# EAGLE design peripheral (EAGLE 9.3.0)
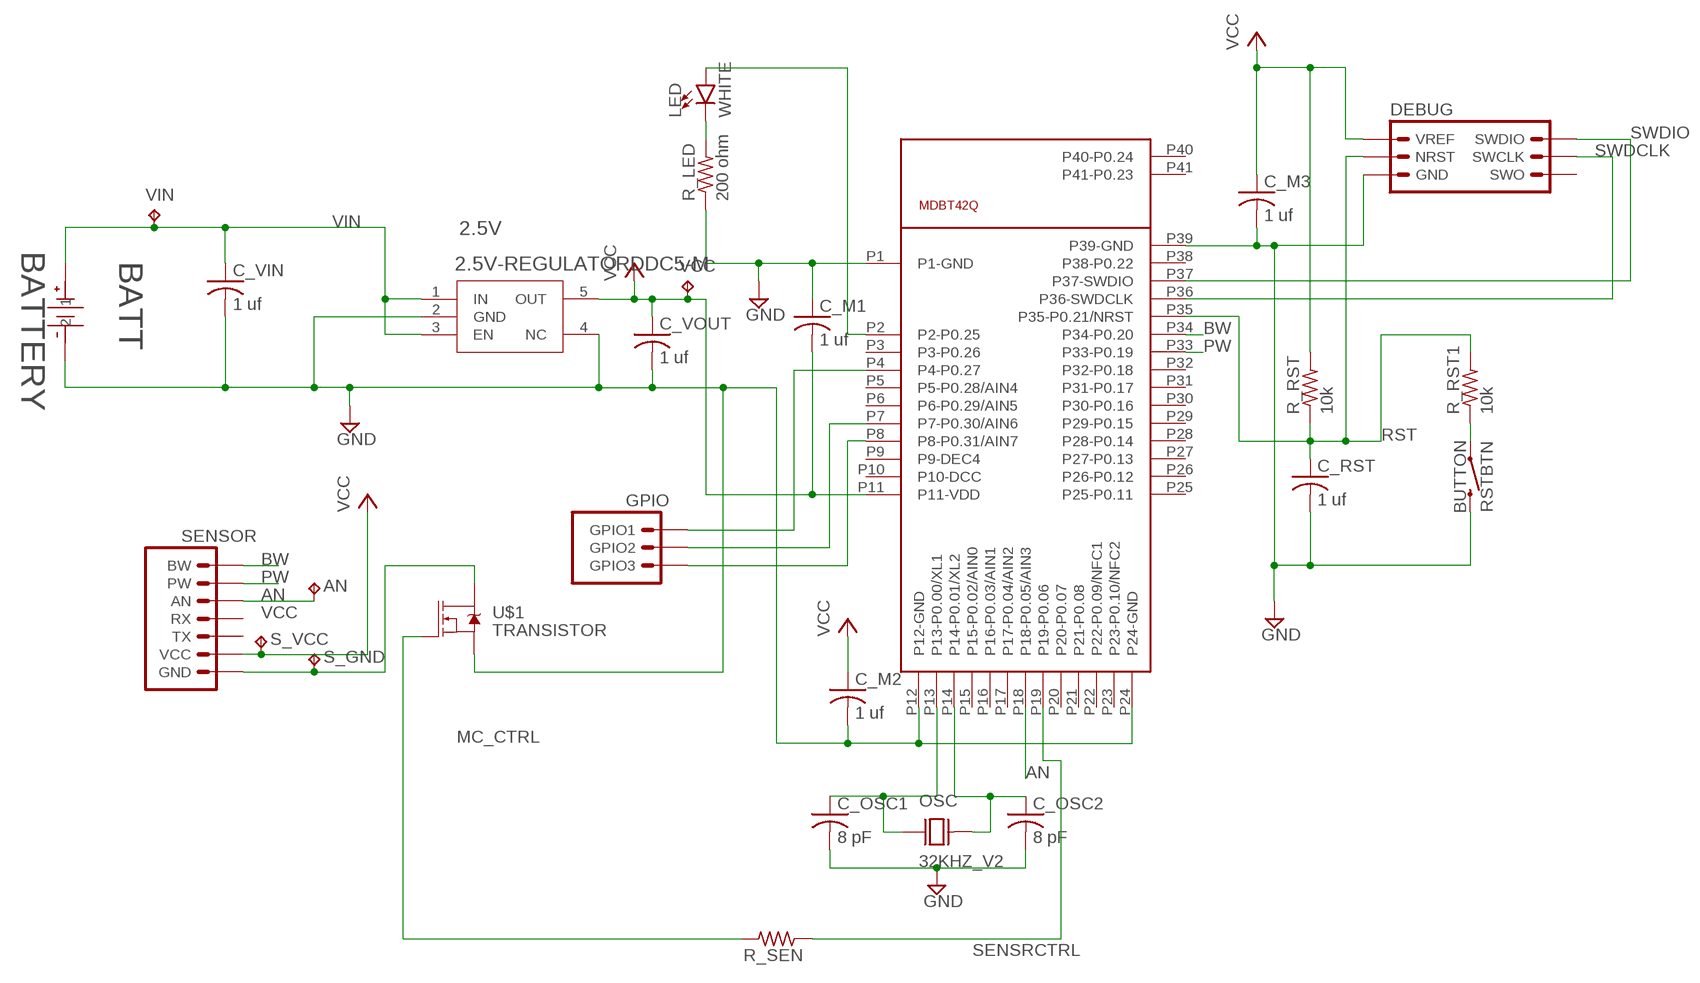
[diagram p0: schematic, sheet 1]

## Parts
2.5V  2.5V-REGULATORDDC5-M  [DDC5-M]
AN  TPTP11SQ  [TP11SQ]
BATT  BATTERY  [BAT_HLDR_2468]
C_M1  1 uf  CAP  [C0805K]
C_M2  1 uf  CAP  [C0805K]
C_M3  1 uf  CAP  [C0805K]
C_OSC1  8 pF  CAP  [C0805K]
C_OSC2  8 pF  CAP  [C0805K]
C_RST  1 uf  CAP  [C0805K]
C_VIN  1 uf  CAP  [C0805K]
C_VOUT  1 uf  CAP  [C0805K]
DEBUG  DEBUGGER  [MA03-2]
GPIO  GPIO  [MA03-1]
LED  WHITE  LED_12061206  [LED-1206]
MICRO  MDBT42Q  [MDBT40]
OSC  32KHZ_V2  [XTAL_AB26TRB-32.768KHZ-T]
R_LED  200 ohm  RESISTOR  [M0805]
R_RST  10k  RESISTOR  [M0805]
R_RST1  10k  RESISTOR  [M0805]
R_SEN  RESISTOR  [M0805]
RSTBTN  BUTTON  [TACTILE_SWITCH_SMD_6.2MM_TALL]
S_GND  TPTP11SQ  [TP11SQ]
S_VCC  TPTP11SQ  [TP11SQ]
SENSOR  SENSORHEADER  [MA07-1]
U$1  TRANSISTOR  [SOT23-3]
VCC  TPTP11SQ  [TP11SQ]
VIN  TPTP11SQ  [TP11SQ]

## Nets
AN: AN.TP MICRO.P18(P18-P0.05/AIN3) SENSOR.5(AN)
BW: MICRO.P34(P34-P0.20) SENSOR.7(BW)
GND: 2.5V.2(GND) 2.5V.4(NC) BATT.2 BATT.3 BATT.4 C_M1.1 C_M2.2 C_M3.2 C_OSC1.2 C_OSC2.2 C_RST.2 C_VIN.2 C_VOUT.2 DEBUG.2(GND) MICRO.P1(P1-GND) MICRO.P12(P12-GND) MICRO.P24(P24-GND) MICRO.P39(P39-GND) R_LED.1 RSTBTN.TOP1 RSTBTN.TOP2 U$1.2_S(S)
MC_CTRL: R_SEN.2 U$1.1_G(G)
N$1: C_OSC1.1 MICRO.P13(P13-P0.00/XL1) OSC.P$3
N$2: LED.C R_LED.2
N$3: C_OSC2.1 MICRO.P14(P14-P0.01/XL2) OSC.P$4
N$4: S_GND.TP SENSOR.1(GND) U$1.3_D(D)
N$6: LED.A MICRO.P2(P2-P0.25)
N$7: R_RST1.1 RSTBTN.BOTTOM1 RSTBTN.BOTTOM2
N$10: GPIO.1(GPIO3) MICRO.P8(P8-P0.31/AIN7)
N$13: GPIO.2(GPIO2) MICRO.P7(P7-P0.30/AIN6)
N$14: GPIO.3(GPIO1) MICRO.P4(P4-P0.27)
PW: MICRO.P33(P33-P0.19) SENSOR.6(PW)
RST: C_RST.1 DEBUG.4(NRST) MICRO.P35(P35-P0.21/NRST) R_RST1.2 R_RST.1
SENSRCTRL: MICRO.P19(P19-P0.06) R_SEN.1
SWDCLK: DEBUG.3(SWCLK) MICRO.P36(P36-SWDCLK)
SWDIO: DEBUG.5(SWDIO) MICRO.P37(P37-SWDIO)
VCC: 2.5V.5(OUT) C_M1.2 C_M2.1 C_M3.1 C_VOUT.1 DEBUG.6(VREF) MICRO.P11(P11-VDD) R_RST.2 S_VCC.TP SENSOR.2(VCC) VCC.TP
VIN: 2.5V.1(IN) 2.5V.3(EN) BATT.1 C_VIN.1 VIN.TP
Unconnected: DEBUG.1(SWO) MICRO.P3(P3-P0.26) MICRO.P5(P5-P0.28/AIN4) MICRO.P6(P6-P0.29/AIN5) MICRO.P9(P9-DEC4) MICRO.P10(P10-DCC) MICRO.P15(P15-P0.02/AIN0) MICRO.P16(P16-P0.03/AIN1) MICRO.P17(P17-P0.04/AIN2) MICRO.P20(P20-P0.07) MICRO.P21(P21-P0.08) MICRO.P22(P22-P0.09/NFC1) MICRO.P23(P23-P0.10/NFC2) MICRO.P25(P25-P0.11) MICRO.P26(P26-P0.12) MICRO.P27(P27-P0.13) MICRO.P28(P28-P0.14) MICRO.P29(P29-P0.15) MICRO.P30(P30-P0.16) MICRO.P31(P31-P0.17) MICRO.P32(P32-P0.18) MICRO.P38(P38-P0.22) MICRO.P40(P40-P0.24) MICRO.P41(P41-P0.23) SENSOR.3(TX) SENSOR.4(RX)

## Library data of the parts
2.5V = third_eye:2.5V-REGULATOR; MANUFACTURER_PART_NUMBER: TLV70025DDCR; VENDOR: Texas Instruments
AN S_GND S_VCC VCC VIN = testpad:TP: Test pad
BATT = third_eye:BATTERY; MANUFACTURER_PART_NUMBER: 2468; VENDOR: SILICON LABS
C_M1-C_M3 C_OSC1 C_OSC2 C_RST C_VIN C_VOUT = third_eye:CAP
DEBUG = third_eye:DEBUGGER: PIN HEADER; OC_FARNELL: unknown; OC_NEWARK: unknown
GPIO = third_eye:GPIO: PIN HEADER; OC_FARNELL: unknown; OC_NEWARK: unknown
LED = third_eye:LED_1206: White SMD LED Used in manufacturing several products at SparkFun. Packages: 0603 - Bright White SMD 0603 package[Product Link] <http://www.kingbrightusa.com/product.asp?catalog_name=LED&product_id=APT1608QWF/D> 1206 - Bright White SMD1206 package [Product Link] <http://www.kingbrightusa.com/product.asp?catalog_name=LED&product_id=APT3216QWF/D> 3014 - Super Bright SMD 3014 package [Datasheet] <http://www.lumileds.com/uploads/459/DS208-pdf> SparkFun Products: Blackberry Trackballer Breakout <https://www.sparkfun.com/products/13169> Digital SandBox <https://www.sparkfun.com/products/12651>; PROD_ID: DIO-09955
MICRO = third_eye:MDBT42Q
OSC = third_eye:32KHZ_V2: AB26TRB Series 32.768 kHz ±20 ppm 12.5 pF -40 to +85°C Cylindrical Watch Crystal; DESCRIPTION: AB26TRB Series 32.768 kHz ±20 ppm 12.5 pF -40 to +85°C Cylindrical Watch Crystal; DIGI-KEY_PART_NUMBER: 535-9033-1-ND; DIGI-KEY_PURCHASE_URL: https://www.digikey.com/product-detail/en/abracon-llc/AB26TRB-32.768KHZ-T/535-9033-1-ND/675581?utm_source=snapeda&utm_medium=aggregator&utm_campaign=symbol; MF: Abracon; MP: AB26TRB-32.768KHZ-T; PACKAGE: Cylindrical Can Radial Abracon
R_LED R_RST R_RST1 R_SEN = third_eye:RESISTOR
RSTBTN = third_eye:BUTTON
SENSOR = third_eye:SENSORHEADER: PIN HEADER; OC_FARNELL: unknown; OC_NEWARK: unknown
U$1 = third_eye:TRANSISTOR

## Board
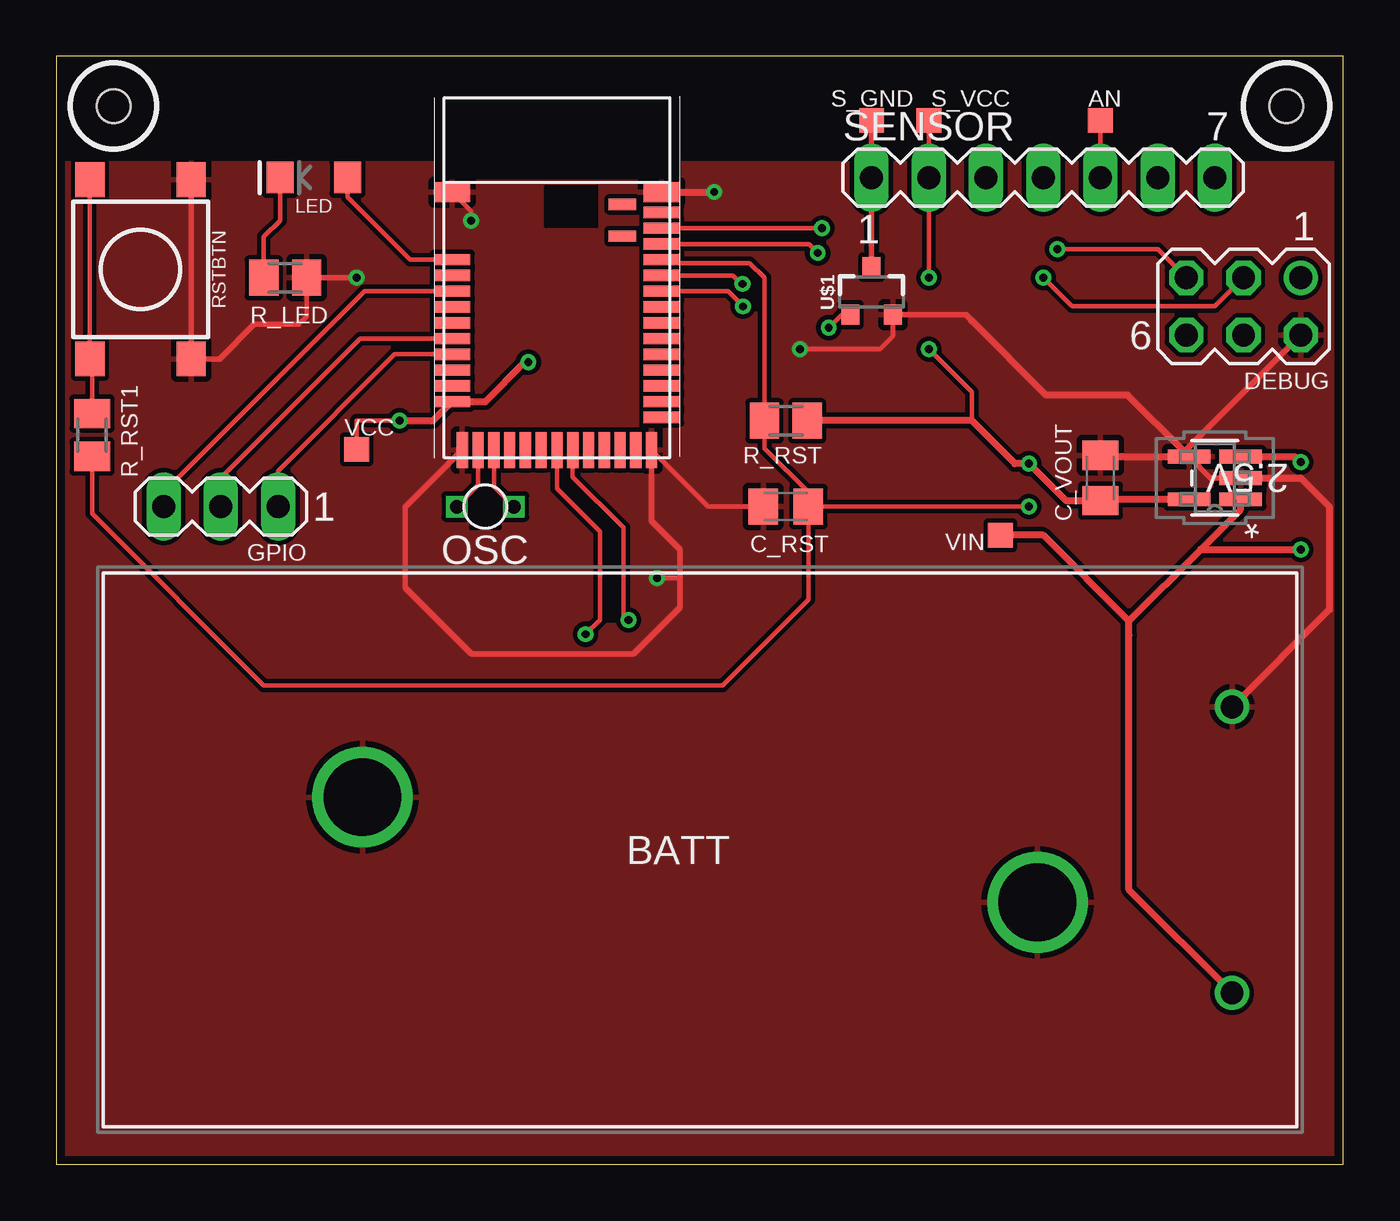
[diagram p1: board, top side]
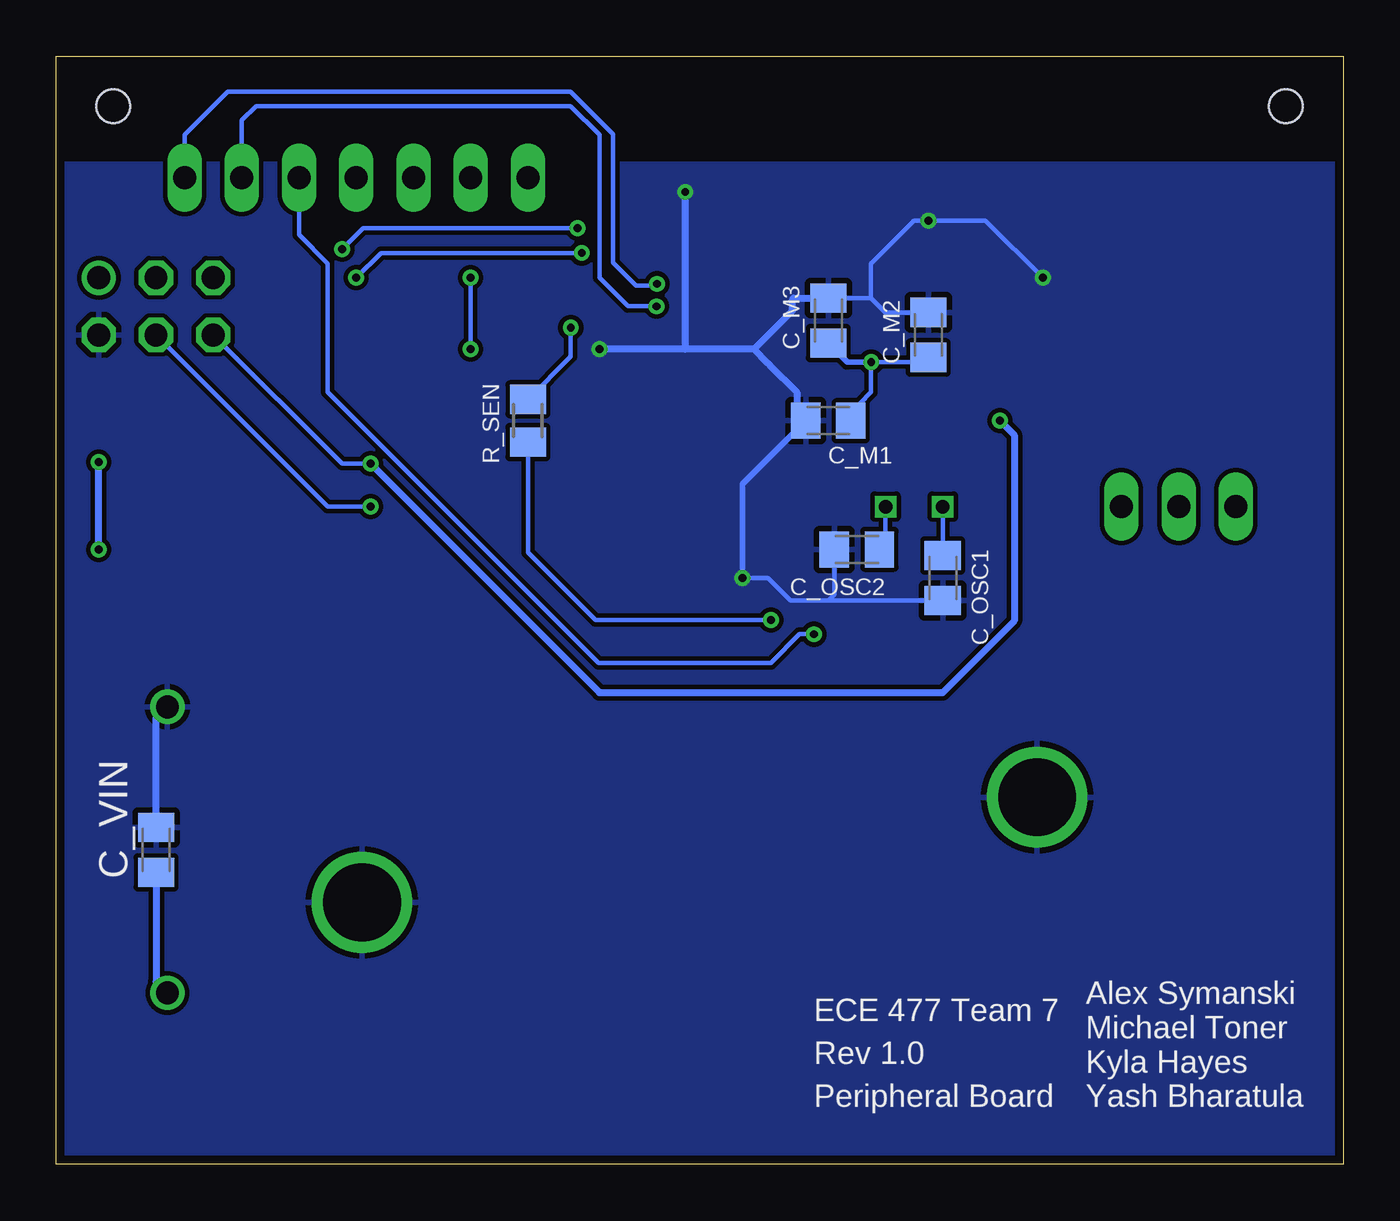
[diagram p2: board, bottom side, seen from below]

Size 57.13 x 49.2 mm. Coordinates in mm from the lower left corner, seen from the top.
Outline: 0,0 57.13,0 57.13,49.2 0,49.2 0,0
Copper layers (1*16): Top 0.0356mm / dielectric 1.5011mm / Bottom 0.0356mm
Design rules "ECE_Senior_Design": minimum track width 8mil, minimum drill 13mil, track to track 8mil, track to pad 8mil, pad to pad 6mil, via to via 8mil, smd to smd 6mil, copper to edge 15mil, drill to drill 8mil, minimum pad ring 7mil, minimum via ring 7mil, stop-mask expansion 3mil, vias tented up to drill 0mil, thermal gap 10mil
Holes 1.5 mm at 2.54,46.99 54.61,46.99
tRestrict: area 22.5,24.1 to 24.8,30.3; area 18.4,28.3 to 19.7,29.5; area 16.8,43.8 to 27.6,45.4

### Footprints (pad centres in the part's own frame; a part is rotated, then mirrored left to right if it is on the bottom)
DDC5-M = smd 1.88 x 0.61: 1 -1.143,0.95; 2 -1.143,0; 3 -1.143,-0.95; 4 1.143,-0.95; 5 1.143,0.95
TP11SQ = smd 1.1 x 1.1: TP 0,0
BAT_HLDR_2468 = drill 1.016 pad 1.524: 1 23.622,-6.35; 2 23.622,6.35 | drill 3.454 pad 3.962: 3 -14.986,2.337; 4 14.986,-2.337
C0805K = smd 1.3 x 1.6: 1 -1,0; 2 1,0
MA03-2 = drill 1.016: 1 -2.54,-1.27 | drill 1.016 octagon: 2 -2.54,1.27; 3 0,-1.27; 4 0,1.27; 5 2.54,-1.27; 6 2.54,1.27
MA03-1 = drill 1.016 long: 1 -2.54,0; 2 0,0; 3 2.54,0
LED-1206 = smd 1.2 x 1.4: A -1.5,0; C 1.5,0
MDBT40 = smd 1.6 x 0.9: P1 -4.65,3.8; P39 4.65,3.8 | smd 1.6 x 0.5: P2 -4.65,0.8; P3 -4.65,0.1; P4 -4.65,-0.6; P5 -4.65,-1.3; P6 -4.65,-2; P7 -4.65,-2.7; P8 -4.65,-3.4; P9 -4.65,-4.1; P10 -4.65,-4.8; P11 -4.65,-5.5; P25 4.65,-6.2; P26 4.65,-5.5; P27 4.65,-4.8; P28 4.65,-4.1; P29 4.65,-3.4; P30 4.65,-2.7; P31 4.65,-2; P32 4.65,-1.3; P33 4.65,-0.6; P34 4.65,0.1; P35 4.65,0.8; P36 4.65,1.5; P37 4.65,2.2; P38 4.65,2.9 | smd 0.5 x 1.6: P12 -4.2,-7.65; P13 -3.5,-7.65; P14 -2.8,-7.65; P15 -2.1,-7.65; P16 -1.4,-7.65; P17 -0.7,-7.65; P18 0,-7.65; P19 0.7,-7.65; P20 1.4,-7.65; P21 2.1,-7.65; P22 2.8,-7.65; P23 3.5,-7.65; P24 4.2,-7.65 | smd 1.2 x 0.5: P40 2.9,3.25; P41 2.9,1.85
XTAL_AB26TRB-32.768KHZ-T = drill 0.6 square: P$3 0,1.27; P$4 0,-1.27
M0805 = smd 1.3 x 1.6: 1 -0.95,0; 2 0.95,0
TACTILE_SWITCH_SMD_6.2MM_TALL = smd 1.55 x 1.3: BOTTOM1 -3.975,-2.25; BOTTOM2 3.975,-2.25; TOP1 -3.975,2.25; TOP2 3.975,2.25
MA07-1 = drill 1.016 long: 1 -7.62,0; 2 -5.08,0; 3 -2.54,0; 4 0,0; 5 2.54,0; 6 5.08,0; 7 7.62,0
SOT23-3 = smd 0.8 x 0.9: 1_G -0.95,-1; 2_S 0.95,-1; 3_D 0,1.1

### Placement (x,y rotation side)
2.5V  51.44,30.48 180 top
AN  46.36,46.35 0 top
BATT  28.57,13.97 0 top
C_M1  22.86,33.02 0 bottom
C_M2  18.41,36.83 90 bottom
C_M3  22.86,37.46 90 bottom
C_OSC1  17.78,26.04 270 bottom
C_OSC2  21.59,27.3 180 bottom
C_RST  32.39,29.21 180 top
C_VIN  52.71,13.97 90 bottom
C_VOUT  46.36,30.48 90 top
DEBUG  52.71,38.1 180 top
GPIO  7.3,29.21 180 top
LED  11.43,43.81 180 top
MICRO  22.22,39.37 0 top
OSC  19.05,29.21 90 top
R_LED  10.16,39.37 180 top
R_RST  32.39,33.02 0 top
R_RST1  1.59,32.38 270 top
R_SEN  36.2,33.02 90 bottom
RSTBTN  3.74,39.74 270 top
S_GND  36.2,46.35 0 top
S_VCC  38.73,46.35 0 top
SENSOR  43.82,43.81 0 top
U$1  36.2,38.73 0 top
VCC  13.34,31.75 0 top
VIN  41.91,27.94 0 top

### Tracks (layer width: path | path; a pad name or v marks a point on that pad's centre or on a via)
AN  (via drill 0.35)
  Top 0.203: v23.49,23.54 24.13,24.18 24.13,28.11 22.22,30.01 MICRO.P18 | AN.TP SENSOR.5
  Bottom 0.203: v23.49,23.54 24.13,23.54 25.4,22.27 33.07,22.27 45.09,34.29 45.09,40 46.36,41.27 SENSOR.5
BW  (via drill 0.35)
  Top 0.203: v30.46,39.1 30.44,39.08 30.05,39.47 MICRO.P34
  Bottom 0.203: v30.46,39.1 30.52,39.03 31.39,39.03 32.41,40.05 32.41,45.74 34.29,47.62 49.53,47.62 51.44,45.72 SENSOR.7
GND  (via drill 0.35)
  Top 0.203: C_RST.2 28.93,29.21 MICRO.P24 | v18.41,41.91 18.41,42.33 MICRO.P1 | 27.69,26.04 v26.67,26.04 | 10.76,37.3 11.11,37.65 R_LED.1 | v33.02,36.2 36.56,36.2 37.15,36.78 U$1.2_S
  Top 0.254: MICRO.P12 15.49,29.18 15.49,25.61 18.43,22.67 25.63,22.67 27.69,24.73 27.69,26.04 27.69,27.3 26.42,28.57 MICRO.P24 | R_LED.1 v13.34,39.37 | DEBUG.2 50.07,31.65 | 2.5V.4 51.24,30.48 2.5V.2 | RSTBTN.TOP1 RSTBTN.TOP2 7.26,35.77 8.79,37.3 10.76,37.3 | U$1.2_S 40.37,37.73 40.64,37.46
  Top 0.305: BATT.2 56.52,24.64 56.52,29.21 55.25,30.48 2.5V.2 | 40.64,37.46 43.94,34.16 47.56,34.16 50.07,31.65 2.5V.4 46.8,31.43 C_VOUT.2 | MICRO.P39 v29.21,43.17 v29.21,43.18
  Bottom 0.203: v13.34,39.37 15.88,41.91 v18.41,41.91 19.05,41.91 20.95,40 20.95,38.46 | 26.67,27.3 v26.67,26.04 25.53,26.04 24.53,25.04 22.86,25.04 | 22.86,27.18 C_OSC2.2 22.59,25.3 22.86,25.04 | 22.86,25.04 C_OSC1.2 | 20.95,38.46 20.32,37.83 C_M2.2 | 20.95,38.46 C_M3.2
  Bottom 0.254: 25.53,35.56 25.46,35.49 | 24.26,33.65 C_M1.1 26.67,30.21 v26.67,26.04
  Bottom 0.305: C_VIN.2 52.71,19.81 BATT.2 | 25.46,35.49 24.26,34.29 24.26,33.65 | 25.53,35.56 26.16,36.2 | 26.16,36.2 29.21,36.2 | 29.21,36.2 v33.02,36.2 | v29.21,43.18 29.21,36.2 | 26.16,36.2 24.45,37.91 24.45,38.42 24.4,38.46 C_M3.2
  pour Bottom: 0,44.45 57.15,44.45 57.15,0 0,0
  pour Top: 0,44.45 57.15,44.45 57.15,0 0,0
MC_CTRL  (via drill 0.35)
  Top 0.203: U$1.1_G 34.88,37.73 v34.29,37.15
  Bottom 0.203: R_SEN.2 34.29,35.88 v34.29,37.15
N$1
  Top 0.203: MICRO.P13 18.72,30.17 18.73,30.16 OSC.P$3
  Bottom 0.203: OSC.P$3 C_OSC1.1
N$2
  Top 0.203: LED.C 9.93,41.91 9.21,41.19 R_LED.2
N$3
  Top 0.203: OSC.P$4 19.42,30.11 MICRO.P14
  Bottom 0.203: OSC.P$4 20.32,27.57 C_OSC2.1
N$4
  Top 0.254: S_GND.TP SENSOR.1 U$1.3_D
N$6
  Top 0.203: MICRO.P2 15.71,40.17 12.93,42.95 LED.A
N$7
  Top 0.203: R_RST1.1 1.59,35.67 RSTBTN.BOTTOM2 RSTBTN.BOTTOM1
N$10
  Top 0.203: GPIO.1 9.84,30.8 15.02,35.97 MICRO.P8
N$13
  Top 0.203: GPIO.2 7.3,30.48 13.49,36.67 MICRO.P7
N$14
  Top 0.203: MICRO.P4 13.69,38.77 4.76,29.84 GPIO.3
PW  (via drill 0.35)
  Top 0.203: v30.48,38.1 29.81,38.77 MICRO.P33
  Bottom 0.203: v30.48,38.1 31.75,38.1 33.02,39.37 33.02,45.72 34.29,46.99 48.26,46.99 48.9,46.35 SENSOR.6
RST  (via drill 0.35)
  Top 0.203: C_RST.1 v43.18,29.21 | R_RST1.2 1.59,28.89 9.21,21.27 29.57,21.27 33.39,25.08 C_RST.1 | C_RST.1 33.39,29.84 31.43,31.79 R_RST.1 31.43,39.37 30.78,40.02 27.02,40.02 MICRO.P35
  Bottom 0.203: DEBUG.4 45.09,29.21 v43.18,29.21
SENSRCTRL  (via drill 0.35)
  Top 0.203: MICRO.P19 22.92,30.52 25.17,28.27 25.17,24.41 v25.4,24.18
  Bottom 0.203: R_SEN.1 36.2,27.18 33.2,24.18 v25.4,24.18
SWDCLK  (via drill 0.35)
  Top 0.203: v33.8,40.47 33.4,40.87 MICRO.P36 | v43.82,39.37 45.09,38.1 51.44,38.1 DEBUG.3
  Bottom 0.203: v43.82,39.37 42.72,40.47 v33.8,40.47
SWDIO  (via drill 0.35)
  Top 0.203: DEBUG.5 48.9,40.64 v44.45,40.64 | MICRO.P37 v34,41.57
  Bottom 0.203: v44.45,40.64 43.52,41.57 v34,41.57
VCC  (via drill 0.35)
  Top 0.203: VCC.TP 13.34,33.02 v15.24,33.02 | S_VCC.TP SENSOR.2 v38.73,39.37 | 40.64,33.02 40.64,34.29 v38.73,36.2
  Top 0.305: v15.24,33.02 16.72,33.02 MICRO.P11 19.05,33.87 20.8,35.62 v20.95,35.62 | 2.5V.5 46.41,29.53 C_VOUT.1 44.82,29.48 v43.18,31.11 42.55,31.11 40.64,33.02 R_RST.2
  Bottom 0.203: DEBUG.6 44.45,31.11 v43.18,31.11 | C_M1.2 21.46,33.78 20.95,34.29 v20.95,35.62 18.63,35.62 C_M2.1 | v38.73,36.2 v38.73,39.37
  Bottom 0.254: C_M3.1 22.01,35.62 v20.95,35.62
  Bottom 0.305: v43.18,31.11 33.02,20.96 17.78,20.96 14.61,24.13 14.61,32.38 v15.24,33.02
VIN  (via drill 0.35)
  Top 0.305: 47.62,24.13 50.8,27.3 | 50.8,27.3 52.58,29.08 2.5V.1 | BATT.1 47.62,12.19 47.62,23.5 47.62,24.13 | 47.62,24.13 43.82,27.94 VIN.TP | 50.8,27.3 v55.25,27.3 | 2.5V.3 55,31.43 v55.25,31.19
  Bottom 0.305: C_VIN.1 52.71,8.13 BATT.1 | v55.25,27.3 v55.25,31.19

### Text on the board
bPlace: ECE 477 Team 7 | Rev 1.0 | Alex Symanski / Michael Toner / Kyla Hayes / Yash Bharatula | Peripheral Board
tNames: R_RST
200bmp: /Users/michaeltoner/Downloads/eye (2).bmp